# EAGLE design Edin_Usher_V2_0 (EAGLE 9.6.2)
COMPANY: Unexpected Maker; DATE: 24-10-2018; DRAWN: Seon; REV: V1; TITLE: TinyPICO
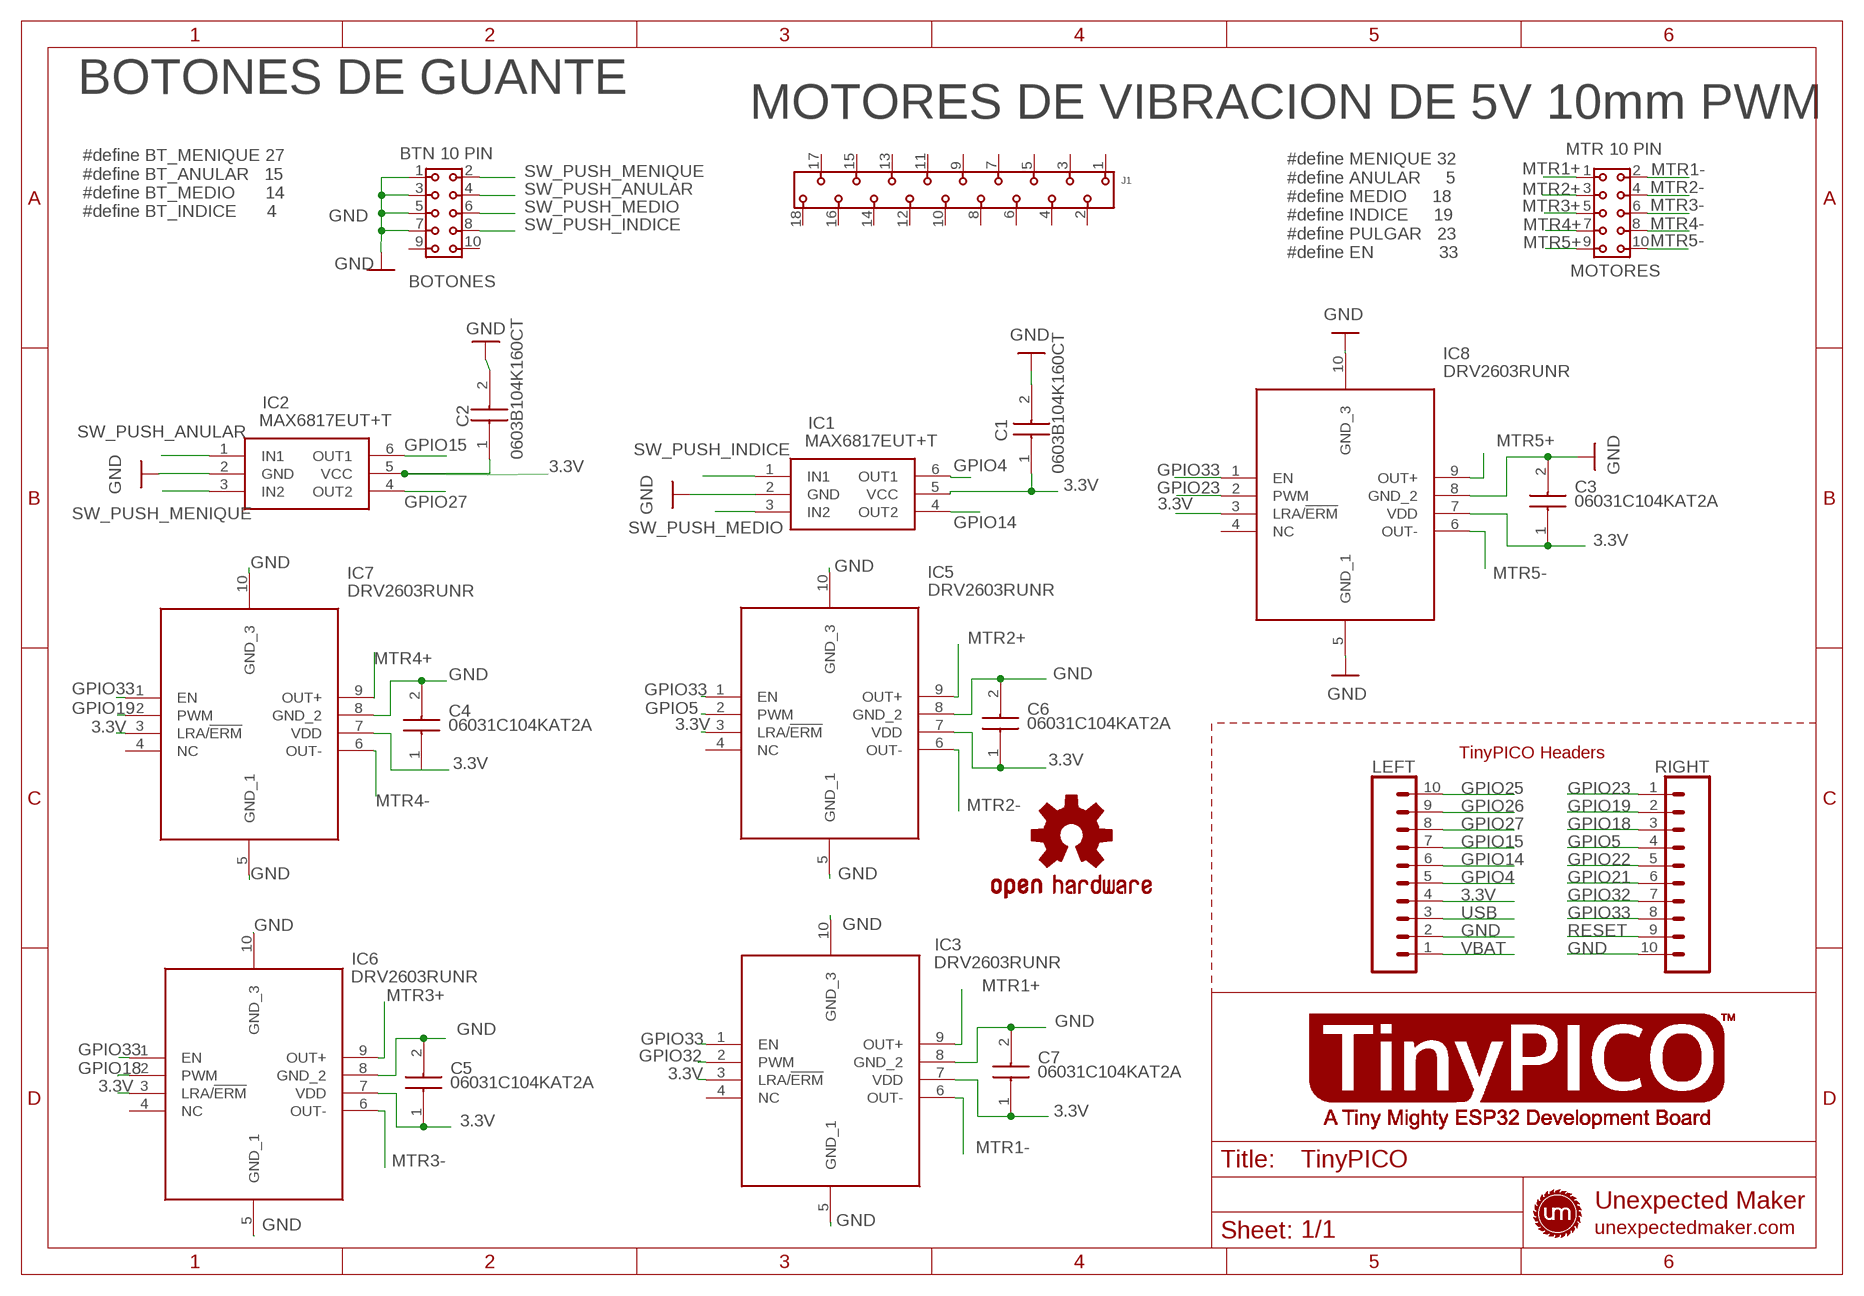
[diagram p0: schematic, sheet 1]

## Parts
BOTONES  BTN 10 PIN  6130XX21821_61301021821  [61301021821]
C1  0603B104K160CT  [CAPC1608X87N]
C2  0603B104K160CT  [CAPC1608X87N]
C3  06031C104KAT2A  [CAPC1608X90N]
C4  06031C104KAT2A  [CAPC1608X90N]
C5  06031C104KAT2A  [CAPC1608X90N]
C6  06031C104KAT2A  [CAPC1608X90N]
C7  06031C104KAT2A  [CAPC1608X90N]
IC1  MAX6817EUT+T  [SOT95P280X145-6N]
IC2  MAX6817EUT+T  [SOT95P280X145-6N]
IC3  DRV2603RUNR  [QFN50P200X200X80-10N]
IC5  DRV2603RUNR  [QFN50P200X200X80-10N]
IC6  DRV2603RUNR  [QFN50P200X200X80-10N]
IC7  DRV2603RUNR  [QFN50P200X200X80-10N]
IC8  DRV2603RUNR  [QFN50P200X200X80-10N]
J1  490107671812  [490107671812]
LEFT  TINYPICO_HEADER_10NO_SILK_PTH_FEMALE  [1X10_NO_SILK]
LOGO1  OSHW-LOGOS  [OSHW-LOGO-S]
MOTORES  MTR 10 PIN  6130XX21821_61301021821  [61301021821]
RIGHT  TINYPICO_HEADER_10NO_SILK_PTH_FEMALE  [1X10_NO_SILK]

## Nets
3.3V: C1.1 C2.1 C3.1 C4.1 C5.1 C6.1 C7.1 IC1.5(VCC) IC2.5(VCC) IC3.3(LRA/!ERM) IC3.7(VDD) IC5.3(LRA/!ERM) IC5.7(VDD) IC6.3(LRA/!ERM) IC6.7(VDD) IC7.3(LRA/!ERM) IC7.7(VDD) IC8.3(LRA/!ERM) IC8.7(VDD) LEFT.4
GND: BOTONES.1 BOTONES.3 BOTONES.5 BOTONES.7 C1.2 C2.2 C3.2 C4.2 C5.2 C6.2 C7.2 IC1.2(GND) IC2.2(GND) IC3.5(GND_1) IC3.8(GND_2) IC3.10(GND_3) IC5.5(GND_1) IC5.8(GND_2) IC5.10(GND_3) IC6.5(GND_1) IC6.8(GND_2) IC6.10(GND_3) IC7.5(GND_1) IC7.8(GND_2) IC7.10(GND_3) IC8.5(GND_1) IC8.8(GND_2) IC8.10(GND_3) LEFT.2 RIGHT.10
GPIO4: IC1.6(OUT1) LEFT.5
GPIO5: IC5.2(PWM) RIGHT.4
GPIO14: IC1.4(OUT2) LEFT.6
GPIO15: IC2.6(OUT1) LEFT.7
GPIO18: IC6.2(PWM) RIGHT.3
GPIO19: IC7.2(PWM) RIGHT.2
GPIO21: RIGHT.6
GPIO22: RIGHT.5
GPIO23: IC8.2(PWM) RIGHT.1
GPIO25: LEFT.10
GPIO26: LEFT.9
GPIO27: IC2.4(OUT2) LEFT.8
GPIO32: IC3.2(PWM) RIGHT.7
GPIO33: IC3.1(EN) IC5.1(EN) IC6.1(EN) IC7.1(EN) IC8.1(EN) RIGHT.8
MTR1+: IC3.9(OUT+) MOTORES.1
MTR1-: IC3.6(OUT-) MOTORES.2
MTR2+: IC5.9(OUT+) MOTORES.3
MTR2-: IC5.6(OUT-) MOTORES.4
MTR3+: IC6.9(OUT+) MOTORES.5
MTR3-: IC6.6(OUT-) MOTORES.6
MTR4+: IC7.9(OUT+) MOTORES.7
MTR4-: IC7.6(OUT-) MOTORES.8
MTR5+: IC8.9(OUT+) MOTORES.9
MTR5-: IC8.6(OUT-) MOTORES.10
RESET: RIGHT.9
SW_PUSH_ANULAR: BOTONES.4 IC2.1(IN1)
SW_PUSH_INDICE: BOTONES.8 IC1.1(IN1)
SW_PUSH_MEDIO: BOTONES.6 IC1.3(IN2)
SW_PUSH_MENIQUE: BOTONES.2 IC2.3(IN2)
USB: LEFT.3
VBAT: LEFT.1
Unconnected: BOTONES.9 BOTONES.10 IC3.4(NC) IC5.4(NC) IC6.4(NC) IC7.4(NC) IC8.4(NC) J1.1 J1.2 J1.3 J1.4 J1.5 J1.6 J1.7 J1.8 J1.9 J1.10 J1.11 J1.12 J1.13 J1.14 J1.15 J1.16 J1.17 J1.18

## Notes on the sheet
- BOTONES DE GUANTE
- MOTORES DE VIBRACION DE 5V 10mm PWM
- #define BT_MENIQUE 27
  #define BT_ANULAR   15
  #define BT_MEDIO      14
  #define BT_INDICE      4
- #define MENIQUE 32
  #define ANULAR     5
  #define MEDIO     18
  #define INDICE     19
  #define PULGAR   23
  #define EN             33
- TinyPICO Headers

## Library data of the parts
BOTONES MOTORES = Wurth_Connectors_WR-PHD:6130XX21821_61301021821: WR-PHD 2.54 mm Dual Socket Header ARTICLE PROPERTIES: Pins:4;​ 6;​ 8;​ 10;​ 12;​ 14;​ 16;​ 18;​ 20;​ 22;​ 24;​ 26;​ 28;​ 30;​ 32;​ 34;​ 36;​ 40;​ 44;​ 64;​ 72 KIND PROPERTIES: Pitch：2.54 mm Quality Class:3 as per CECC 75 301-802 Rows：Dual Gender：Socket Header Type：Straight MATERIAL PROPERTIES: Insulator Material :PBT Insulator Flammability Rating:UL94 V-0 Contact Material:Copper Alloy Contact Plating:Gold Contact Type:Stamped GENERAL INFORMATION Operating Temperature:-40 up to +125 °C Compliance:Lead free / RoHS ELECTRICAL PROPERTIES: Rated Current:3 A IR 1:3 A Withstanding Voltage:500 V (AC) Contact Resistance:20 mΩ RISO:1000 MΩ CERTIFICATION UL Approval:E323964 PACKAGING PROPERTIES Packaging:Tray <https://katalog.we-online.com/media/images/v2/o57948v209%20Family_Dual_Socket_Header_WR-PHD_6130xx21821.jpg> Details see: https://katalog.we-online.com/en/em/PHD_2_54_DUAL_SOCKET_HEADER_6130XX21821 Updated by Yingchun,Shan 2019-10-21 2019 (C) Würth Elektronik; DATASHEET-URL: https://katalog.we-online.com/em/datasheet/61301021821.pdf; GENDER: Socket Header; IR: 3A; MATES: WR-PHD 2.54mm SMT Dual Pin Header/THT Angled Dual Pin Header/THT Dual Board Stacker/THT Dual Pin Header; PACKAGING: Tray; PART-NUMBER: 61301021821; PINS: 10; ROWS: Dual; TYPE: Straight
C1 C2 = SamacSys_Parts:0603B104K160CT: WALSIN - 0603B104K160CT - CAP, 0.1F, 16V, 10%, X7R, 0603 Source: Datasheet <https://componentsearchengine.com/Datasheets/1/0603B104K160CT.pdf>; DESCRIPTION: WALSIN - 0603B104K160CT - CAP, 0.1F, 16V, 10%, X7R, 0603; HEIGHT: 0.87mm; MANUFACTURER_NAME: Walsin Technology Corporation; MANUFACTURER_PART_NUMBER: 0603B104K160CT; MOUSER_PART_NUMBER: 791-0603B104K160CT; MOUSER_PRICE-STOCK: https://www.mouser.com/Search/Refine.aspx?Keyword=791-0603B104K160CT
C3-C7 = SamacSys_Parts:06031C104KAT2A: AVX - 06031C104KAT2A - CAP, MLCC, X7R, 0.1UF, 100V, 0603 Source: Datasheet <https://componentsearchengine.com/Datasheets/1/06031A100FAT2A.pdf>; DESCRIPTION: AVX - 06031C104KAT2A - CAP, MLCC, X7R, 0.1UF, 100V, 0603; HEIGHT: 0.9mm; MANUFACTURER_NAME: AVX; MANUFACTURER_PART_NUMBER: 06031C104KAT2A; MOUSER_PART_NUMBER: 581-06031C104KAT2A; MOUSER_PRICE-STOCK: https://www.mouser.co.uk/ProductDetail/AVX/06031C104KAT2A?qs=oF%2FSscNnLpBUv12UcNAw2A%3D%3D
IC1 IC2 = SamacSys_Parts:MAX6817EUT+T: Supervisory Circuits Dual Switch Debouncer Source: Datasheet <http://datasheets.maximintegrated.com/en/ds/MAX6816-MAX6818.pdf>; DESCRIPTION: Supervisory Circuits Dual Switch Debouncer; HEIGHT: 1.45mm; MANUFACTURER_NAME: Maxim Integrated; MANUFACTURER_PART_NUMBER: MAX6817EUT+T; MOUSER_PART_NUMBER: 700-MAX6817EUTT; MOUSER_PRICE-STOCK: https://www.mouser.co.uk/ProductDetail/Maxim-Integrated/MAX6817EUT%2bT?qs=1THa7WoU59HkU%2FfQtsyW%252BA%3D%3D
IC3 IC5-IC8 = SamacSys_Parts:DRV2603RUNR: Haptic Driver with Auto Resonance Tracking for LRA and Optimized Drive for ERM Source: Datasheet <http://www.ti.com/lit/gpn/drv2603>; DESCRIPTION: Haptic Driver with Auto Resonance Tracking for LRA and Optimized Drive for ERM; HEIGHT: 0.8mm; MANUFACTURER_NAME: Texas Instruments; MANUFACTURER_PART_NUMBER: DRV2603RUNR; MOUSER_PART_NUMBER: 595-DRV2603RUNR; MOUSER_PRICE-STOCK: https://www.mouser.co.uk/ProductDetail/Texas-Instruments/DRV2603RUNR?qs=l6ZoeTYLMwNhoGl8Q31%2FaA%3D%3D
J1 = Wurth_Connectors_WR-WST:490107671812: WR-WST REDFIT IDC SKEDD For permanent application up to 10g vibration stable PACKAGING PROPERTIES Packaging Tube ELECTRICAL PROPERTIES IR1 1 A RISO 1000 MΩ Withstanding Voltage 500 V (AC) Contact Resistance 10 mΩ PROPERTIES Insulator Material LCP Insulator Flammability Rating UL94 V-0 Insulator Color Black Contact Material CuNiSi Contact Plating Au (SKEDD), Sn (IDC) Pitch 2.54 mm Cable AWG 28/1.27 mm ribbon cable Operating Temperature -25 up to +105 °C Compliance Lead free / RoHS <https://katalog.we-online.com/media/images/v2/o104848v209%20Single_WR-WST_REDFIT.jpg> Details see: https://katalog.we-online.com/en/em/REDFIT_IDC_SKEDD Updated By Ella Wu 2019-05-21 2019 (C) Wurth Elektronik; CONTACT-RESISTANCE: 10mOhm; DATASHEET-URL: https://katalog.we-online.com/em/datasheet/490107671812.pdf; GENDER: Transition; IR: 1A; L: 30.45mm; PACKAGING: Tube; PART-NUMBER: 490107671812; PINS: 18; PITCH: 2.54mm; TOL-R: max.; USE-WITH: WR-CAB 1.27 mm Ribbon Flat Cable/WR-CAB 1.27 mm Ribbon Flat Cable 1 m pieces; WE-NUMBER: 490107671812; WORKING-VOLTAGE: 100V(AC)
LEFT RIGHT = UnexpectedMaker:TINYPICO_HEADER_10: Multi connection point. Often used as Generic Header-pin footprint for 0.1 inch spaced/style header connections On any of the 0.1 inch spaced packages, you can populate with these: Break Away Headers - Straight <https://www.sparkfun.com/products/116> (PRT-00116) Break Away Male Headers - Right Angle <https://www.sparkfun.com/products/553> (PRT-00553) Female Headers <https://www.sparkfun.com/products/115> (PRT-00115) Break Away Headers - Machine Pin <https://www.sparkfun.com/products/117> (PRT-00117) Break Away Female Headers - Swiss Machine Pin <https://www.sparkfun.com/products/743> (PRT-00743) Arduino Stackable Header - 10 Pin <https://www.sparkfun.com/products/11376> (PRT-11376) For SCREWTERMINALS and SPRING TERMINALS visit here: Screw Terimnals on SparkFun.com <https://www.sparkfun.com/search/results?term=Screw+Terminals> (5mm/3.5mm/2.54mm spacing) This device is also useful as a general connection point to wire up your design to another part of your project. Our various solder wires solder well into these plated through hole pads. Hook-Up Wire - Assortment (Stranded, 22 AWG) <https://www.sparkfun.com/products/11375> (PRT-11375) Hook-Up Wire - Assortment (Solid Core, 22 AWG) <https://www.sparkfun.com/products/11367> (PRT-11367) View the entire wire category on our website here <https://www.sparkfun.com/categories/141> Special notes: Molex polarized connector foot print use with SKU : PRT-08231 with associated crimp pins and housings. 1MM SMD Version SKU: PRT-10208 NOTES ON THE VARIANTS LOCK and LOCK_LONGPADS... This footprint was designed to help hold the alignment of a through-hole component (i.e. 6-pin header) while soldering it into place. You may notice that each hole has been shifted either up or down by 0.005 of an inch from it's more standard position (which is a perfectly straight line). This slight alteration caused the pins (the squares in the middle) to touch the edges of the holes. Because they are alternating, it causes a "brace" to hold the component in place. 0.005 has proven to be the perfect amount of "off-center" position when using our standard breakaway headers. Although looks a little odd when you look at the bare footprint, once you have a header in there, the alteration is very hard to notice. Also,if you push a header all the way into place, it is covered up entirely on the bottom side.; PROD_ID: CONN-11563
LOGO1 = SparkFun-Aesthetics:OSHW-LOGO: Open-Source Hardware (OSHW) Logo This logo indicates the piece of hardware it is found on incorporates a OSHW license and/or adheres to the definition of open source hardware found here: http://freedomdefined.org/OSHW

## Board
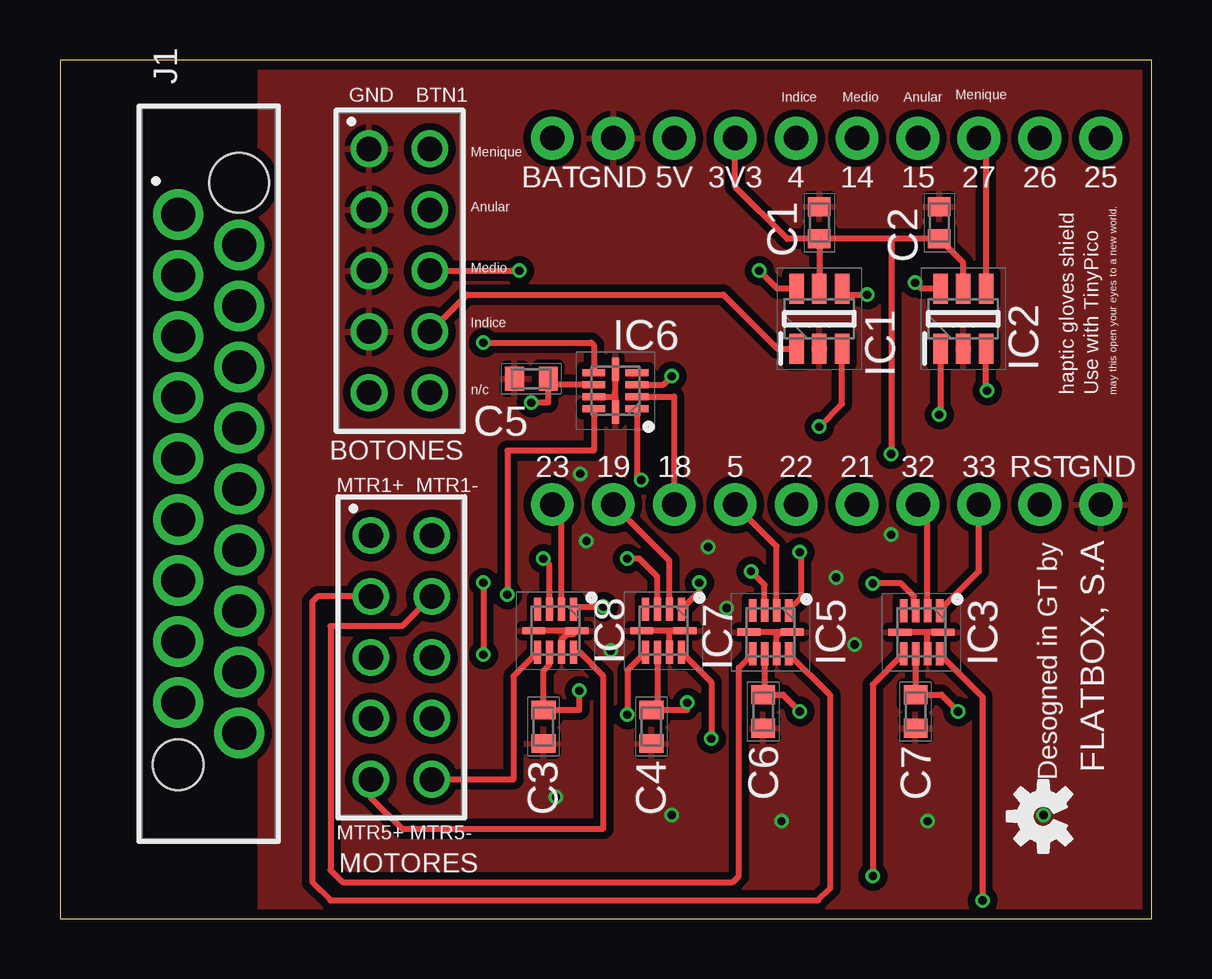
[diagram p1: board, top side]
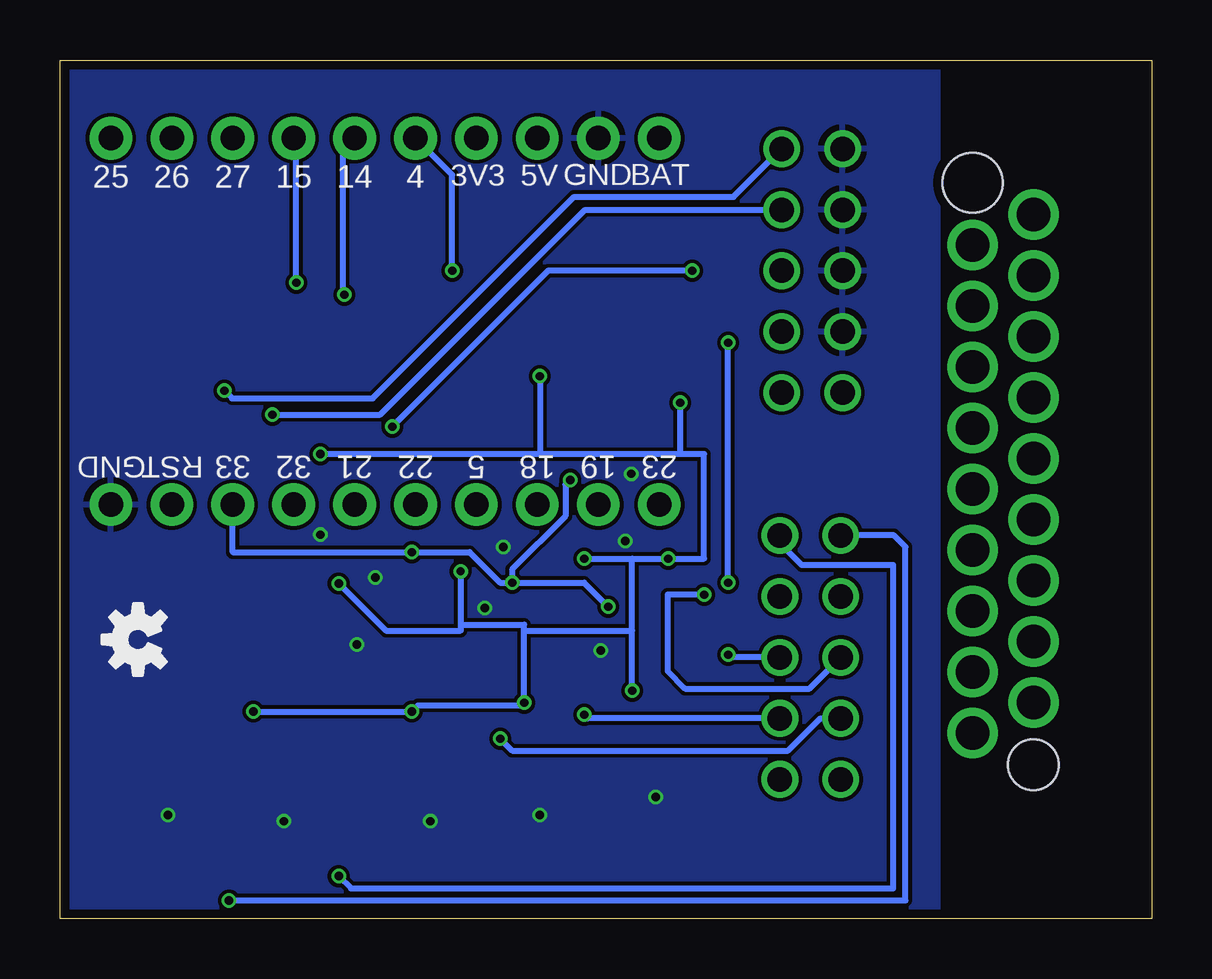
[diagram p2: board, bottom side, seen from below]

Size 45.5 x 35.78 mm. Coordinates in mm from the lower left corner, seen from the top.
Outline: 0,35.78 0,0 45.5,0 45.5,35.78 0,35.78
Copper layers (1*16): Top 0.035559375mm / dielectric 1.6mm / Bottom 0.035559375mm
Design rules "oshpark-2layer": minimum track width 6mil, minimum drill 10mil, track to track 6mil, track to pad 6mil, pad to pad 6mil, via to via 6mil, smd to smd 6mil, copper to edge 15mil, drill to drill 6mil, minimum pad ring 5mil, minimum via ring 5mil, stop-mask expansion 2.5mil, vias tented up to drill 0mil, thermal gap 10mil

### Footprints (pad centres in the part's own frame; a part is rotated, then mirrored left to right if it is on the bottom)
61301021821 = drill 1.02: 1 -5.08,-1.27; 2 -5.08,1.27; 3 -2.54,-1.27; 4 -2.54,1.27; 5 0,-1.27; 6 0,1.27; 7 2.54,-1.27; 8 2.54,1.27; 9 5.08,-1.27; 10 5.08,1.27
CAPC1608X87N = smd 0.8 x 0.94: 1 -0.67,0; 2 0.67,0
CAPC1608X90N = smd 0.78 x 0.99: 1 -0.7,0; 2 0.7,0
SOT95P280X145-6N = smd 1.25 x 0.6: 1 -1.25,0.95; 2 -1.25,0; 3 -1.25,-0.95; 4 1.25,-0.95; 5 1.25,0; 6 1.25,0.95
QFN50P200X200X80-10N = smd 0.95 x 0.3: 1 -0.9,0.75; 2 -0.9,0.25; 3 -0.9,-0.25; 4 -0.9,-0.75; 6 0.9,-0.75; 7 0.9,-0.25; 8 0.9,0.25; 9 0.9,0.75 | smd 0.3 x 0.95: 5 0,-0.9; 10 0,0.9
490107671812 = drill 1.4 pad 1.75: 1 10.795,1.27; 2 9.525,-1.27; 3 8.255,1.27; 4 6.985,-1.27; 5 5.715,1.27; 6 4.445,-1.27; 7 3.175,1.27; 8 1.905,-1.27; 9 0.635,1.27; 10 -0.635,-1.27; 11 -1.905,1.27; 12 -3.175,-1.27; 13 -4.445,1.27; 14 -5.715,-1.27; 15 -6.985,1.27; 16 -8.255,-1.27; 17 -9.525,1.27; 18 -10.795,-1.27 | hole 2.1: -12.125,1.27 | hole 2.5: 12.125,-1.27
1X10_NO_SILK = drill 1.016 pad 1.778: 1 0,0; 2 2.54,0; 3 5.08,0; 4 7.62,0; 5 10.16,0; 6 12.7,0; 7 15.24,0; 8 17.78,0; 9 20.32,0; 10 22.86,0

### Placement (x,y rotation side)
BOTONES  14.15,27 270 top
C1  31.65,29 90 top
C2  36.65,29 90 top
C3  20.15,8 270 top
C4  24.65,8 270 top
C5  19.65,22.5 180 top
C6  29.31,8.63 270 top
C7  35.66,8.63 270 top
IC1  31.65,25 90 top
IC2  37.65,25 90 top
IC3  35.92,11.94 270 top
IC5  29.62,11.94 270 top
IC6  23.15,22 180 top
IC7  25.15,12 270 top
IC8  20.65,12 270 top
J1  6.2,18.54 90 top
LEFT  20.52,32.52 0 top
LOGO1  40.98,4.27 90 top
LOGO2  OSHW-LOGOS  [OSHW-LOGO-S]  42.25,11.63 90 bottom
MOTORES  14.23,10.89 270 top
RIGHT  20.52,17.26 0 top

### Tracks (layer width: path | path; a pad name or v marks a point on that pad's centre or on a via)
3.3V  (via drill 0.35)
  Top 0.254: C1.1 30.32,28.33 28.14,30.51 LEFT.4 | 34.65,28.33 C1.1 | C1.1 IC1.5 | IC8.7 20.4,10.58 20.15,10.33 C3.1 21.65,8.7 v21.65,9.5 | IC8.3 20.4,14.75 v20.15,15 | IC7.3 24.9,14.25 24.15,15 v23.65,15 | IC7.7 24.9,8.95 C4.1 26.15,8.7 v26.15,9 | IC6.7 20.35,22.25 C5.1 20.35,21.5 v19.65,21.5 | IC6.3 25.15,22.25 v25.5,22.6 | IC5.3 29.37,13.91 v28.8,14.48 | IC5.7 29.37,9.4 C6.1 30.14,9.33 v30.84,8.63 | IC3.3 35.59,12.91 35.59,13.43 35.05,13.97 v33.88,13.97 | IC3.7 C7.1 36.74,9.33 v37.44,8.63 | 34.65,28.33 v34.65,19.36 | IC2.5 37.65,27.33 C2.1 34.65,28.33
  Bottom 0.254: v21.65,9.5 21.65,12 | 21.65,12 21.65,15 | 21.65,15 v20.15,15 18.65,15 18.65,19.36 19.65,19.36 | 19.65,19.36 25.5,19.36 | 25.5,19.36 v34.65,19.36 | v23.65,15 21.65,15 | 26.15,12 v26.15,9 26.26,8.89 30.58,8.89 v30.84,8.63 v37.44,8.63 | 26.15,12 26.15,12.25 28.8,12.25 | 26.15,12 21.65,12 | v19.65,21.5 19.65,19.36 | v25.5,22.6 25.5,19.36 | v28.8,14.48 28.8,12.25 | 28.8,12.25 28.8,12 31.92,12 v33.88,13.97
GND  (via drill 0.35)
  Top 0.254: IC8.8 20.9,11.62 21.14,11.85 21.41,11.85 IC8.10 IC8.5 | IC7.8 25.4,12 IC7.10 IC7.5 | IC6.8 23.15,21.75 IC6.10 IC6.5 | IC5.10 30.07,11.94 | 30.07,11.94 IC5.5 | IC5.8 29.87,11.74 30.07,11.94 | IC3.10 36.17,11.94 | 36.17,11.94 IC3.5 | IC3.8 36.17,11.93 36.17,11.94
  other vias: 30.07,4.06 25.5,4.32 20.68,5.08 27.03,15.49 22.96,11.17 27.79,12.95 36.17,4.06 33.12,11.43 32.36,14.22 34.65,16 41,4.32 21.95,15.75 21.69,18.54
  pour Top (isolate 0.305): 8.3,37.1 8.3,-1.33 45.32,-1.33 45.32,37.1
  pour Bottom: 45.54,36.41 45.54,-0.64 8.88,-0.64 8.88,36.41
GPIO4  (via drill 0.35)
  Top 0.254: IC1.6 29.9,26.25 v29.15,27
  Bottom 0.254: v29.15,27 29.15,30.99 LEFT.5
GPIO5
  Top 0.254: IC5.2 29.87,15.53 RIGHT.4
GPIO14  (via drill 0.35)
  Top 0.254: IC1.4 32.85,26 v33.65,26
  Bottom 0.254: LEFT.6 33.72,32.02 33.72,26.07 v33.65,26
GPIO15  (via drill 0.35)
  Top 0.254: IC2.6 35.9,26.25 v35.65,26.5
  Bottom 0.254: v35.65,26.5 35.65,32.41 LEFT.7
GPIO18
  Top 0.254: IC6.2 25.6,21.75 RIGHT.3
GPIO19
  Top 0.254: IC7.2 25.4,14.92 RIGHT.2
GPIO23
  Top 0.254: IC8.2 20.9,16.88 RIGHT.1
GPIO27
  Top 0.254: IC2.4 38.6,32.22 LEFT.8
GPIO32
  Top 0.254: IC3.2 36.17,16.86 RIGHT.7
GPIO33  (via drill 0.35)
  Top 0.254: IC8.1 21.5,13 v22.65,13 | IC7.1 26.65,13.65 v26.65,14 | IC6.1 24.05,18.47 v24.23,18.29 | IC5.1 30.88,13.35 30.88,15.22 v30.84,15.27 | IC3.1 38.3,14.47 RIGHT.8
  Bottom 0.254: v26.65,14 27.16,14 28.43,15.27 v30.84,15.27 38.3,15.27 RIGHT.8 | v26.65,14 23.65,14 v22.65,13 | v24.23,18.29 24.44,18.08 24.44,16.77 26.65,14.56 v26.65,14
MTR1+  (via drill 0.35)
  Top 0.254: IC3.9 38.46,9.25 v38.46,0.76
  Bottom 0.254: v38.46,0.76 10.26,0.76 10.26,15.49 10.74,15.97 MOTORES.1
MTR1-  (via drill 0.35)
  Top 0.254: IC3.6 33.88,9.75 v33.88,1.78
  Bottom 0.254: v33.88,1.78 33.38,1.27 10.77,1.27 10.77,14.73 14.58,14.73 15.5,15.65 MOTORES.2
MTR2+
  Top 0.254: MOTORES.3 10.74,13.43 10.52,13.21 10.52,1.52 11.28,0.76 31.6,0.76 32.11,1.27 32.11,9.31 IC5.9
MTR2-
  Top 0.254: MOTORES.4 14.26,12.19 11.28,12.19 11.28,2.03 11.79,1.52 28.04,1.52 28.3,1.78 28.3,10.47 IC5.6
MTR3+  (via drill 0.35)
  Top 0.254: IC6.9 22.25,19.5 18.65,19.5 v18.65,13.5
  Bottom 0.254: v18.65,13.5 20.18,13.5 20.18,10.32 19.45,9.59 14.26,9.59 MOTORES.5
MTR3-  (via drill 0.35)
  Top 0.254: v17.65,14 v17.65,11 | v17.65,24 22.15,24 22.25,23.9 IC6.6
  Bottom 0.254: MOTORES.6 17.54,10.89 v17.65,11 | v17.65,14 v17.65,24
MTR4+  (via drill 0.35)
  Top 0.254: IC7.9 27.15,9.85 v27.15,7.5
  Bottom 0.254: v27.15,7.5 26.65,7 15.15,7 13.8,8.35 MOTORES.7
MTR4-  (via drill 0.35)
  Top 0.254: v23.65,8.5 23.65,10.35 IC7.6
  Bottom 0.254: MOTORES.8 23.5,8.35 v23.65,8.5
MTR5+
  Top 0.254: MOTORES.9 12.96,5.05 14.25,3.75 22.65,3.75 22.65,10.1 22.2,10.56 22.2,10.59 21.69,11.1 IC8.9
MTR5-
  Top 0.254: IC8.6 18.9,10.1 18.9,5.81 MOTORES.10
SW_PUSH_ANULAR  (via drill 0.35)
  Top 0.254: IC2.1 36.7,21.05 v36.65,21
  Bottom 0.254: v36.65,21 32.15,21 23.61,29.54 BOTONES.4
SW_PUSH_INDICE
  Top 0.254: BOTONES.8 16.96,26 27.65,26 29.9,23.75 IC1.1
SW_PUSH_MEDIO  (via drill 0.35)
  Top 0.254: BOTONES.6 v19.15,27 | v31.65,20.5 32.6,21.45 IC1.3
  Bottom 0.254: v19.15,27 25.15,27 v31.65,20.5
SW_PUSH_MENIQUE  (via drill 0.35)
  Top 0.254: v38.65,22 38.6,22.05 IC2.3
  Bottom 0.254: BOTONES.2 17.42,30.08 24.07,30.08 32.47,21.68 38.34,21.68 v38.65,22

### Text on the board
tPlace: Menique | GND | BTN1 | Indice | Medio | Anular | Menique | Anular | Medio | Indice | n/c | haptic gloves shield | Use with TinyPico | may this open your eyes to a new world. | MTR1+ | MTR1- | Desogned in GT by | FLATBOX, S.A | MTR5+ | MTR5-
tNames: BAT | GND | 5V | 3V3 | 4 | 14 | 15 | 27 | 26 | 25 | 23 | 19 | 18 | 5 | 22 | 21 | 32 | 33 | RST | GND
bNames: BAT | GND | 5V | 3V3 | 4 | 14 | 15 | 27 | 26 | 25 | RST | GND | 23 | 19 | 18 | 5 | 22 | 21 | 32 | 33